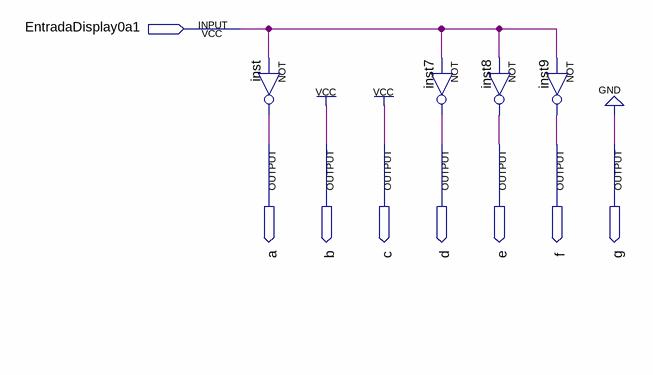
[diagram p0: schematic sheet]
// Quartus schematic Display0a1.bdf as structural Verilog: 4 symbols, 8 pins
module Display0a1 (
  input  EntradaDisplay0a1,
  output a,
  output b,
  output c,
  output d,
  output e,
  output f,
  output g
);

  not inst (a, EntradaDisplay0a1);
  not inst7 (d, EntradaDisplay0a1);
  not inst8 (e, EntradaDisplay0a1);
  not inst9 (f, EntradaDisplay0a1);

  assign b = 1'b1;
  assign c = 1'b1;
  assign g = 1'b0;
endmodule
